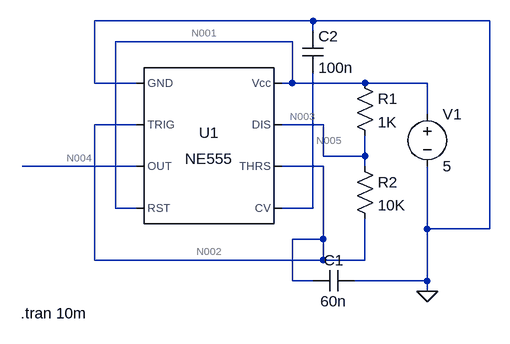
[diagram p0: schematic capacitor_measure.asc]
capacitor_measure.asc, the LTspice schematic file:
Version 4
SHEET 1 880 680
WIRE 512 -96 176 -96
WIRE 784 -96 512 -96
WIRE 512 -80 512 -96
WIRE 480 -64 208 -64
WIRE 176 0 176 -96
WIRE 240 0 176 0
WIRE 480 0 480 -64
WIRE 480 0 464 0
WIRE 592 0 480 0
WIRE 688 0 592 0
WIRE 688 48 688 0
WIRE 240 64 176 64
WIRE 528 64 464 64
WIRE 528 112 528 64
WIRE 592 112 592 80
WIRE 592 112 528 112
WIRE 240 128 64 128
WIRE 528 128 464 128
WIRE 592 128 592 112
WIRE 208 192 208 -64
WIRE 240 192 208 192
WIRE 512 192 512 -16
WIRE 512 192 464 192
WIRE 688 224 688 128
WIRE 784 224 784 -96
WIRE 784 224 688 224
WIRE 528 240 528 128
WIRE 528 240 480 240
WIRE 176 272 176 64
WIRE 528 272 528 240
WIRE 528 272 176 272
WIRE 592 272 592 208
WIRE 592 272 528 272
WIRE 480 304 480 240
WIRE 512 304 480 304
WIRE 688 304 688 224
WIRE 688 304 576 304
WIRE 688 320 688 304
FLAG 688 320 0
SYMBOL Misc\\NE555 352 96 R0
SYMATTR InstName U1
SYMBOL voltage 688 32 R0
WINDOW 123 0 0 Left 0
WINDOW 39 0 0 Left 0
SYMATTR InstName V1
SYMATTR Value 5
SYMBOL res 576 -16 R0
SYMATTR InstName R1
SYMATTR Value 1K
SYMBOL res 576 112 R0
SYMATTR InstName R2
SYMATTR Value 10K
SYMBOL cap 576 288 R90
WINDOW 0 0 32 VBottom 2
WINDOW 3 32 32 VTop 2
SYMATTR InstName C1
SYMATTR Value 60n
SYMBOL cap 496 -80 R0
SYMATTR InstName C2
SYMATTR Value 100n
TEXT 62 354 Left 2 !.tran 10m

The netlist it stands for:
* capacitor_measure.asc
XU1 0 N002 N004 N001 N005 N002 N003 N001 NE555  ; pins GND TRIG OUT RST CV THRS DIS Vcc
V1 N001 0 5
R1 N001 N003 1K
R2 N003 N002 10K
C1 0 N002 60n
C2 0 N005 100n
.tran 10m
.lib NE555.sub
.backanno
.end

* Results of the author's LTspice run, read from the files saved beside the schematic
* Operating Point, zero values left out:
*   V(n002) = 5 V
*   V(n005) = 3.333 V
*   V(n001) = 5 V
*   V(n003) = 5 V
*   V(n004) = 5 V
*   I(R1) = 16.67 nA
*   I(R2) = 10 nA
*   I(V1) = -1.611 mA
*   Ix(u1:1) = -1.611 mA
*   Ix(u1:2) = 5 nA
*   Ix(u1:4) = 22.67 µA
*   Ix(u1:6) = 5 nA
*   Ix(u1:7) = 6.672 nA
*   Ix(u1:8) = 1.588 mA
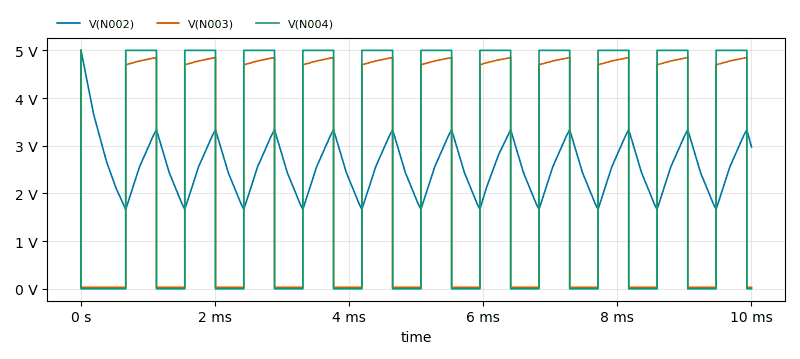
[diagram p1: Transient Analysis of capacitor_measure.asc, plotted from the saved traces]
* Transient Analysis, 1 run:
*   V(N002): min 1.665 V, max 5 V, average 2.548 V, rms 2.625 V, last 2.975 V
*   V(N003): min 30.8 mV, max 5 V, average 2.425 V, rms 3.394 V, last 31.58 mV
*   V(N004): min 30 µV, max 5 V, average 2.52 V, rms 3.55 V, last 30 µV